# Altium project ChargingDock.PrjPcb
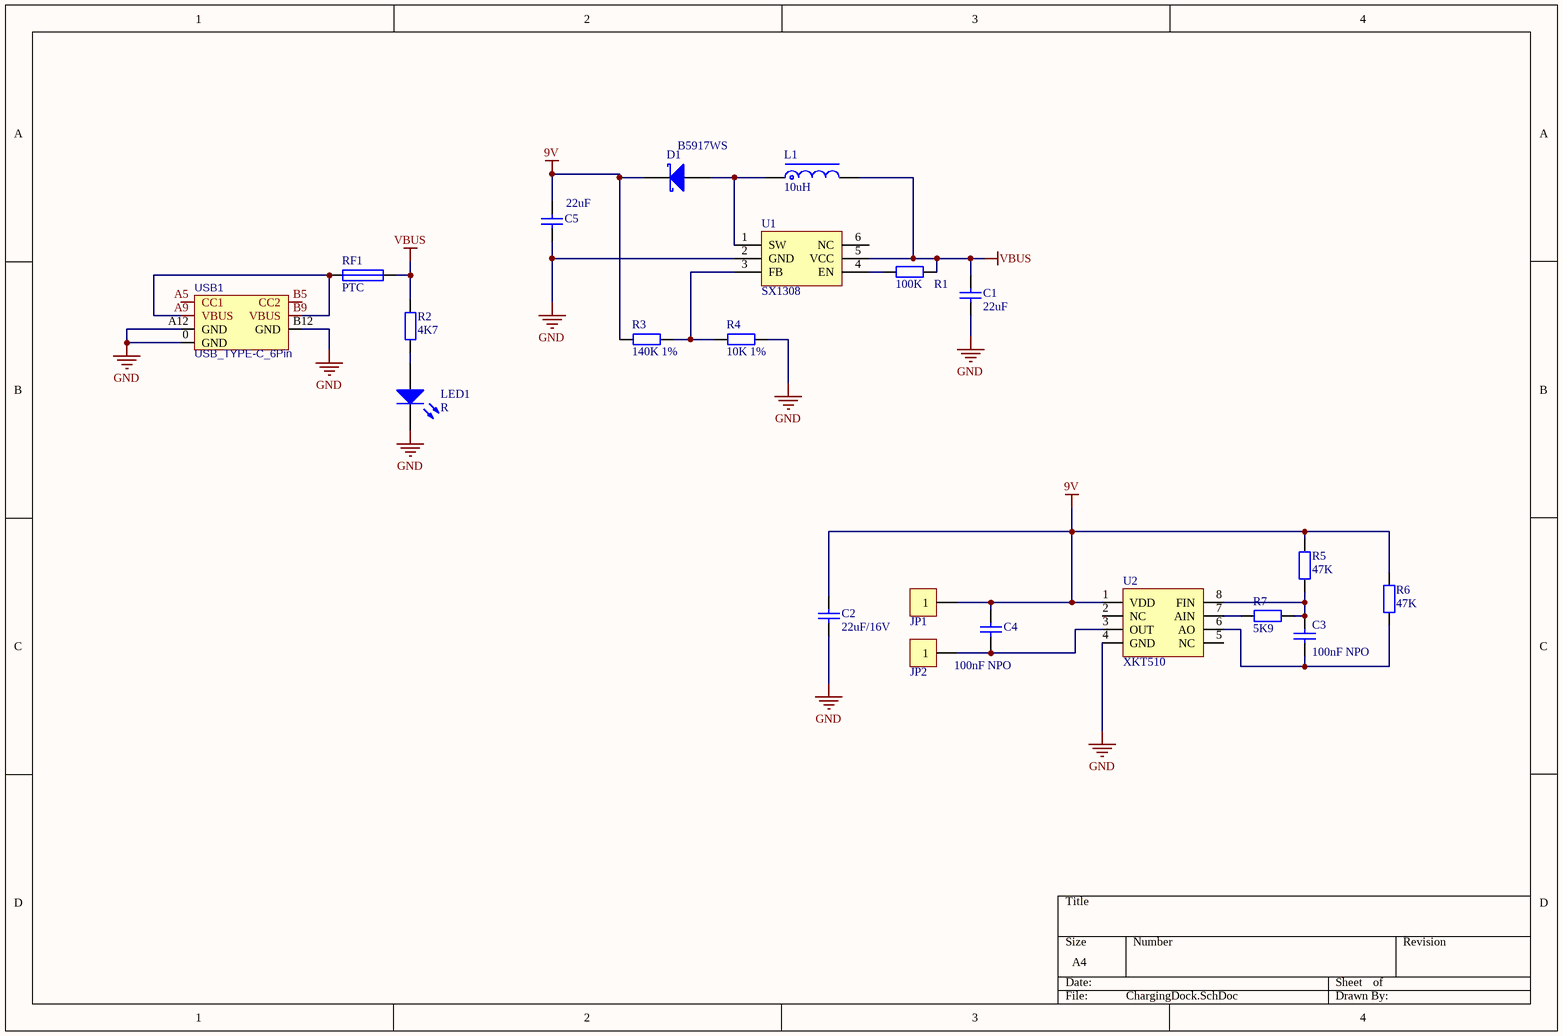
[diagram p0: ChargingDock.SchDoc]
1 sheet, 21 parts. Net scope: global (net labels, ports and power ports of the same name join across sheets).
Board file: ChargingDock.PcbDoc

## Sheet ChargingDock.SchDoc
size A4; SheetNumber: 1; SheetTotal: 1

### Parts
C1  22uF  [C0805_L]
C2  22uF/16V  [C1206_M]
C3  100nF NPO  [C0603_M]
C4  100nF NPO  [C1206_M]
C5  22uF  [C1206_M]
D1  B5917WS  [SOD-123]
JP1  HDR-1x1  [HDR2.54-LI-1P]  (value not drawn)
JP2  HDR-1x1  [HDR2.54-LI-1P]  (value not drawn)
L1  10uH  [SWPA3015]
LED1  R  [LED0603_G]
R1  100K  [R0603_M]
R2  4K7  [R0603_M]
R3  140K 1%  [R0603_M]
R4  10K 1%  [R0603_M]
R5  47K  [R0603_M]
R6  47K  [R0603_M]
R7  5K9  [R0603_M]
RF1  PTC  [FU 1206]
U1  SX1308  [SOT23-6N]
U2  XKT510  [SOP8]
USB1  USB_TYPE-C_6Pin  [USB-C-SMD_6P]

### Nets
9V: C2.2 C4.2 C5.2 D1.2(K) JP1.1 R3.1 R5.2 R6.2 U2.1(VDD)
GND: C1.2 C2.1 C5.1 LED1.2(K) R4.2 U1.2(GND) U2.4(GND) USB1.0(GND) USB1.A12(GND) USB1.B12(GND)
VBUS: C1.1 L1.2 R1.2 R2.2 RF1.2 U1.5(VCC)
NetC3_1: C3.1 R6.1 U2.6(AO)
NetC3_2: C3.2 R5.1 R7.1 U2.8(FIN)
NetC4_1: C4.1 JP2.1 U2.3(OUT)
NetD1_1: D1.1(A) L1.1 U1.1(SW)
NetLED1_1: LED1.1(A) R2.1
NetR1_1: R1.1 U1.4(EN)
NetR3_2: R3.2 R4.1 U1.3(FB)
NetR7_2: R7.2 U2.7(AIN)
NetRF1_1: RF1.1 USB1.A9(VBUS) USB1.B9(VBUS)

Not connected (* = marked no-connect by the designer): U1 6(NC); U2 2(NC) 5(NC); USB1 A5(CC1) B5(CC2)

### Library data of the parts
C1-C5 = C: 贴片电容/MLCC电容; BOM名称: 无极性贴片电容; 联系下单店铺卖家 免费帮你查找封装: 联系下单店铺卖家 免费技术支持
D1 = 1N5817: 肖特基二极管; 以赠品形式获赠本封装库的买家，还可联系卖家免费指导AD软件使用: 封装库来自淘宝卖家ID：黄晶宝石; BOM名称: 肖特基二极管
JP1 JP2 = Header 1: 1P接插件; BOM名称: 2P接插件; 联系卖家，免费查找封装: 唯一出售店铺网址https://shop463601444.taobao.com; 封装库来自淘宝卖家ID：黄晶宝石: 其他店铺购入均为盗版封装库，请立即申请退款，本店现金奖励50~200元
L1 = L-SWPA: 顺络_SWPA贴片屏蔽电感; BOM名称: 功率屏蔽电感; 联系下单店铺卖家 免费帮你查找封装: 联系下单店铺卖家 免费技术支持
LED1 = LED: 贴片LED; 封装库来自淘宝卖家：黄晶宝石: 其他店铺购入均为盗版封装库，请立即申请退款，本店现金奖励200~1000元; BOM名称: 贴片LED
R1-R7 = R: 贴片电阻; 联系下单店铺卖家 免费帮你查找封装: 联系下单店铺卖家 免费技术支持; BOM名称: 贴片电阻
RF1 = FU-PPTC_SMD: PPTC贴片自恢复保险丝; BOM名称: PPTC自恢复保险丝; 联系卖家，免费查找封装: 唯一出售店铺网址https://shop463601444.taobao.com; 封装库来自淘宝卖家：黄晶宝石: 其他店铺购入均为盗版封装库，请立即申请退款，本店现金奖励200~1000元
U1 = SX1308: 可调2A升压芯片; BOM名称: 可调升压芯片; 封装库来自淘宝卖家：黄晶宝石: 其他店铺购入的买家，请立即申请退款，本店现金奖励200~1000元
U2 = XKT510: XKT510无线充充电芯片
USB1 = USB_TYPE-C_6Pin: USB_TYPE-C_6Pin母座; 联系下单店铺卖家 免费帮你查找封装: 封装库来自淘宝卖家ID：黄晶宝石